# Altium project Car_Circuitry.PrjPcb
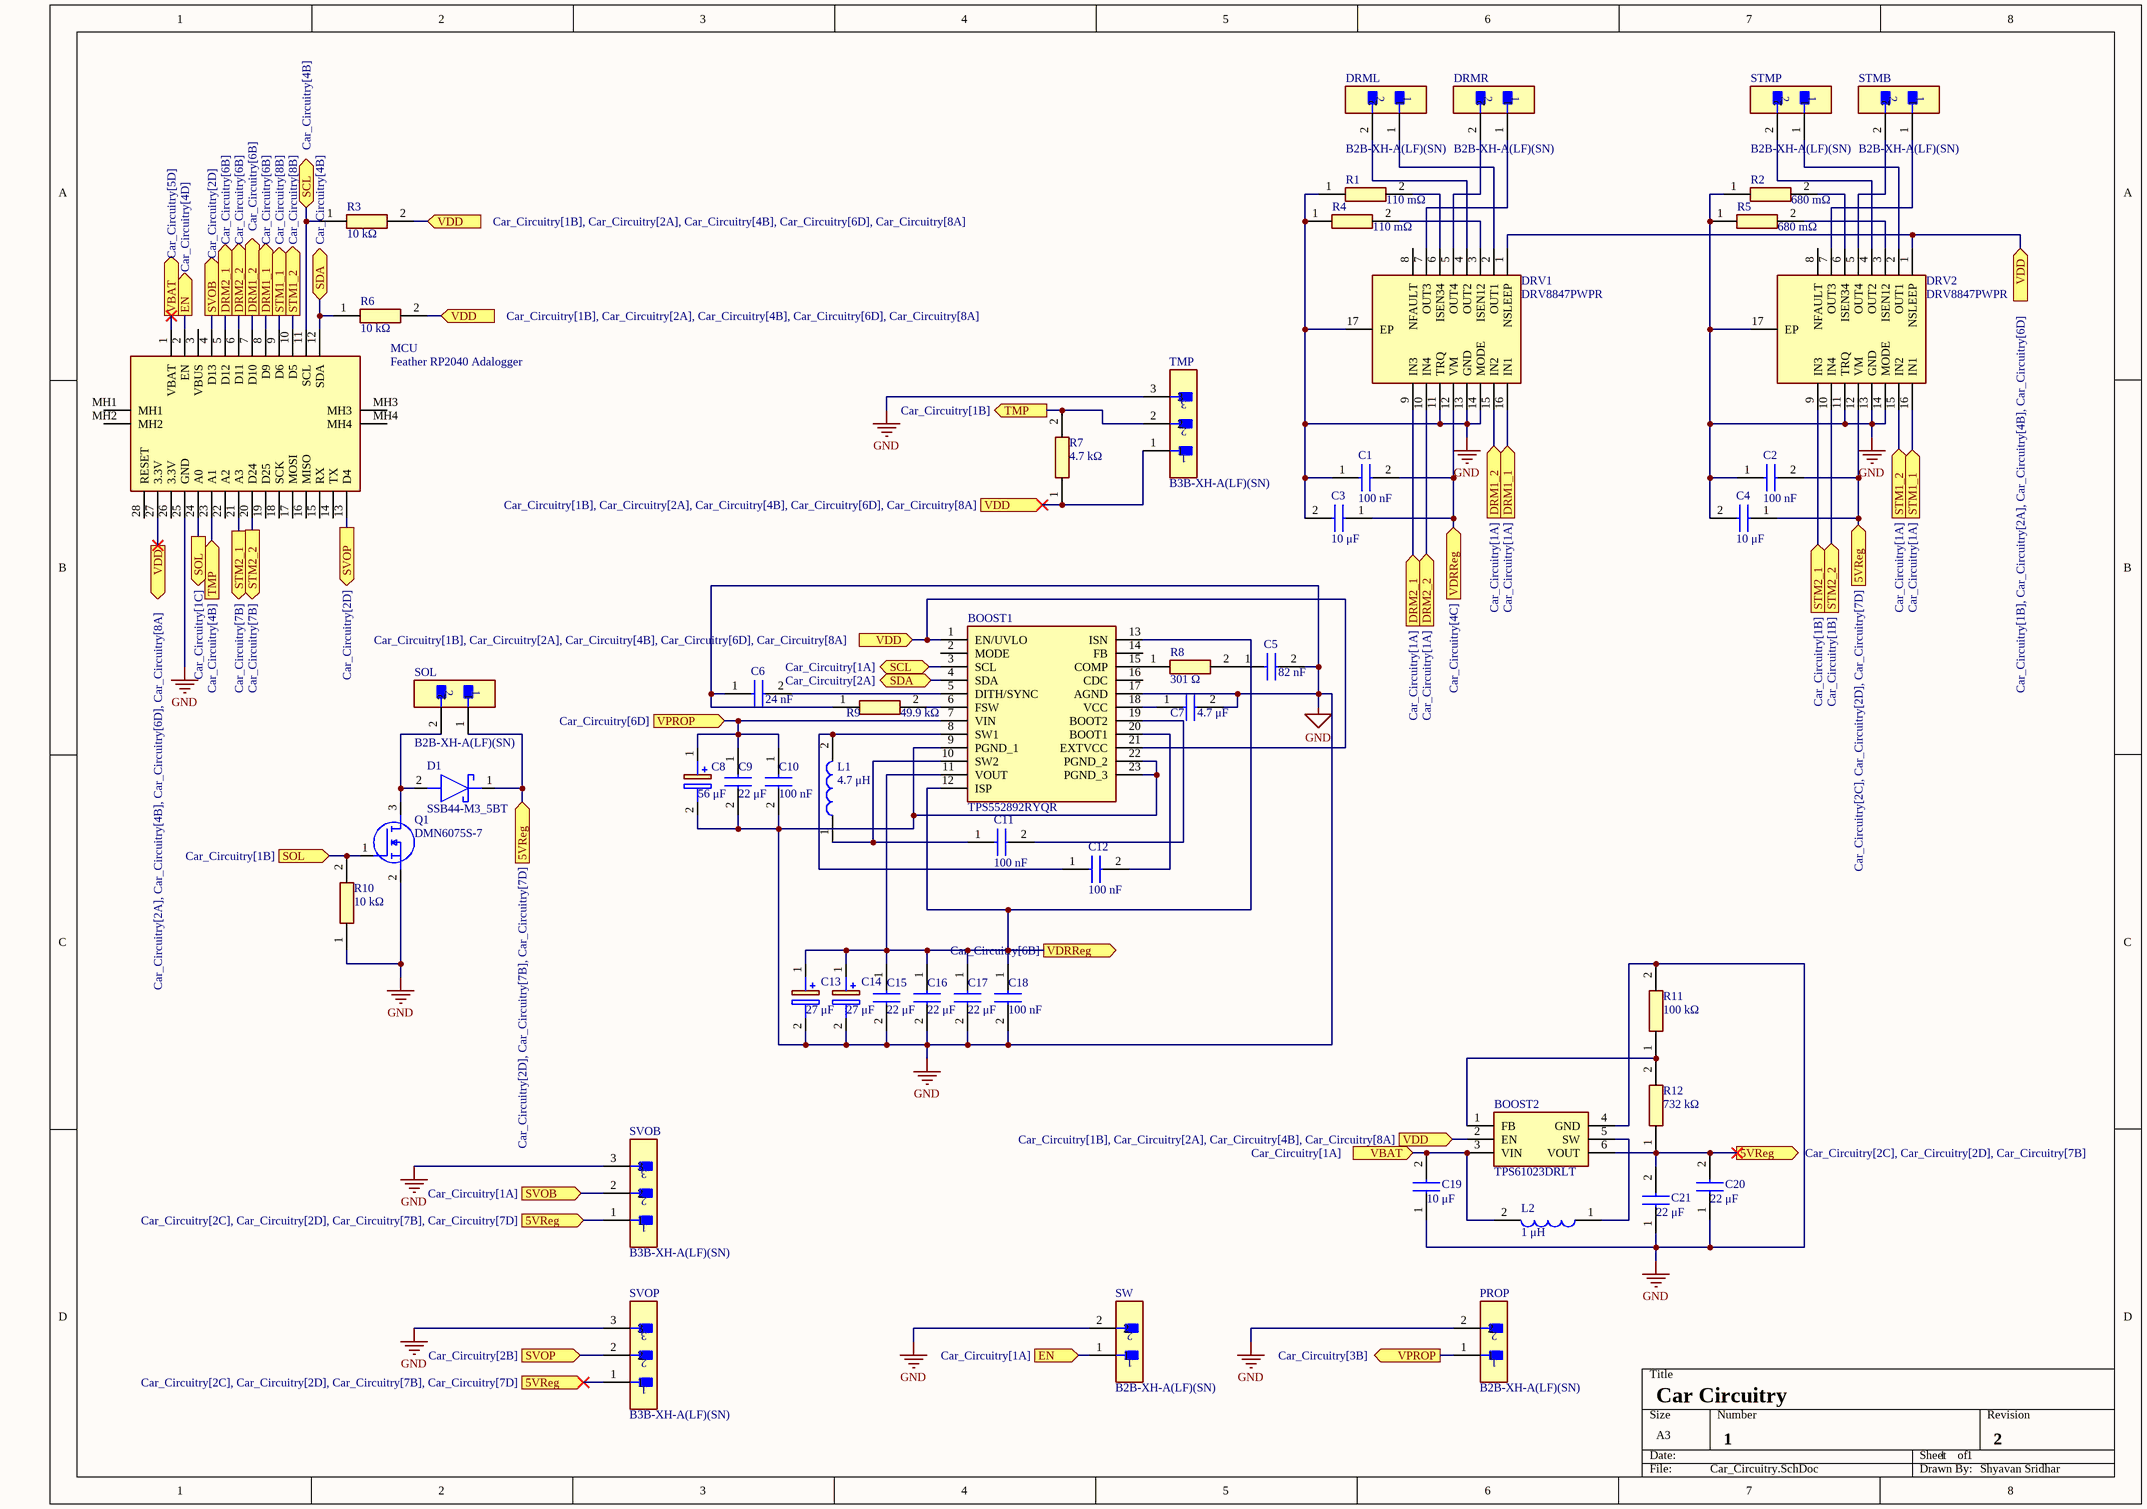
[diagram p0: Car_Circuitry.SchDoc]
2 sheets, 58 parts. Net scope: flat (ports and power ports of the same name join across sheets).
Board files: Car_Circuitry.PcbDoc, Steering_Daughterboard.PcbDoc
Sheets:
  Car_Circuitry.SchDoc
  Steering_Daughterboard.SchDoc

## Sheet Car_Circuitry.SchDoc
size A3; SheetNumber: 1; SheetTotal: 2

### Parts
BOOST1  TPS552892RYQR  [TPS552892RYQR]
BOOST2  TPS61023DRLT  [SOTFL50P160X60-6N]
C1  100 nF  [CAPC2012X95N]
C2  100 nF  [CAPC2012X95N]
C3  10 μF  [CAPC2012X140N]
C4  10 μF  [CAPC2012X140N]
C5  82 nF  [CAPC1005X55N]
C6  24 nF  [CAPC2013X94N]
C7  4.7 μF  [CAPC1608X80N]
C8  56 μF  [16SVF82M]
C9  22 μF  [CAPC3225X270N]
C10  100 nF  [CAPC1005X55N]
C11  100 nF  [CAPC1005X55N]
C12  100 nF  [CAPC1005X55N]
C13  27 μF  [16SVF82M]
C14  27 μF  [16SVF82M]
C15  22 μF  [CAPC3225X270N]
C16  22 μF  [CAPC3225X270N]
C17  22 μF  [CAPC3225X270N]
C18  100 nF  [CAPC1005X55N]
C19  10 μF  [CAPC2012X140N]
C20  22 μF  [CAPC3216X180N]
C21  22 μF  [CAPC3216X180N]
D1  SSB44-M3_5BT  [DIOM5436X244N]
DRML  B2B-XH-A(LF)(SN)  [FP-B2B-XH-A_LF_SN-MFG]
DRMR  B2B-XH-A(LF)(SN)  [FP-B2B-XH-A_LF_SN-MFG]
DRV1  DRV8847PWPR  [SOP65P640X120-17N]
DRV2  DRV8847PWPR  [SOP65P640X120-17N]
L1  4.7 μH  [INDPM6664X610N]
L2  1 μH  [74438357010]
MCU  Feather RP2040 Adalogger  [2796]
PROP  B2B-XH-A(LF)(SN)  [FP-B2B-XH-A_LF_SN-MFG]
Q1  DMN6075S-7  [SOT96P240X110-3N]
R1  110 mΩ  [ERJ6_B_BW_R_LW_CW_D]
R2  680 mΩ  [ERJ6_B_BW_R_LW_CW_D]
R3  10 kΩ  [RESC2012X70N]
R4  110 mΩ  [ERJ6_B_BW_R_LW_CW_D]
R5  680 mΩ  [ERJ6_B_BW_R_LW_CW_D]
R6  10 kΩ  [RESC2012X70N]
R7  4.7 kΩ  [RESAD1530W60L610D230]
R8  301 Ω  [RESC1005X40N]
R9  49.9 kΩ  [ERJ2RKD1004X]
R10  10 kΩ  [RESC2012X70N]
R11  100 kΩ  [ERJ8ENF1000V]
R12  732 kΩ  [ERJ8ENF1000V]
SOL  B2B-XH-A(LF)(SN)  [FP-B2B-XH-A_LF_SN-MFG]
STMB  B2B-XH-A(LF)(SN)  [FP-B2B-XH-A_LF_SN-MFG]
STMP  B2B-XH-A(LF)(SN)  [FP-B2B-XH-A_LF_SN-MFG]
SVOB  B3B-XH-A(LF)(SN)  [FP-B3B-XH-A_LF_SN-MFG]
SVOP  B3B-XH-A(LF)(SN)  [FP-B3B-XH-A_LF_SN-MFG]
SW  B2B-XH-A(LF)(SN)  [FP-B2B-XH-A_LF_SN-MFG]
TMP  B3B-XH-A(LF)(SN)  [FP-B3B-XH-A_LF_SN-MFG]

### Ports
5VReg (in, see Car_Circuitry[2C], Car_Circuitry[2D], Car_Circuitry[7B], Car_Circuitry[7D]), 5VReg (in, see Car_Circuitry[2C], Car_Circuitry[2D], Car_Circuitry[7D]), 5VReg (in, see Car_Circuitry[2D], Car_Circuitry[7B], Car_Circuitry[7D]), 5VReg (out, see Car_Circuitry[2C], Car_Circuitry[2D], Car_Circuitry[7B]), DRM1_1 (in, see Car_Circuitry[1A]), DRM1_1 (out, see Car_Circuitry[6B]), DRM1_2 (in, see Car_Circuitry[1A]), DRM1_2 (out, see Car_Circuitry[6B]), DRM2_1 (in, see Car_Circuitry[1A]), DRM2_1 (out, see Car_Circuitry[6B]), DRM2_2 (in, see Car_Circuitry[1A]), DRM2_2 (out, see Car_Circuitry[6B]), EN (in, see Car_Circuitry[1A]), EN (out, see Car_Circuitry[4D]), SCL (bidir, see Car_Circuitry[1A]), SCL (bidir, see Car_Circuitry[4B]), SDA (bidir, see Car_Circuitry[2A]), SDA (bidir, see Car_Circuitry[4B]), SOL (in, see Car_Circuitry[1B]), SOL (out, see Car_Circuitry[1C]), STM1_1 (in, see Car_Circuitry[1A]), STM1_1 (out, see Car_Circuitry[8B]), STM1_2 (in, see Car_Circuitry[1A]), STM1_2 (out, see Car_Circuitry[8B]), STM2_1 (in, see Car_Circuitry[1B]), STM2_1 (out, see Car_Circuitry[7B]), STM2_2 (in, see Car_Circuitry[1B]), STM2_2 (out, see Car_Circuitry[7B]), SVOB (in, see Car_Circuitry[1A]), SVOB (out, see Car_Circuitry[2D]), SVOP (in, see Car_Circuitry[2B]), SVOP (out, see Car_Circuitry[2D]), TMP (in, see Car_Circuitry[4B]), TMP (out, see Car_Circuitry[1B]), VBAT (in, see Car_Circuitry[1A]), VBAT (out, see Car_Circuitry[5D]), VDD (in, see Car_Circuitry[1B], Car_Circuitry[2A], Car_Circuitry[4B], Car_Circuitry[6D]), VDD (in, see Car_Circuitry[1B], Car_Circuitry[2A], Car_Circuitry[4B], Car_Circuitry[6D], Car_Circuitry[8A]), VDD (in, see Car_Circuitry[1B], Car_Circuitry[2A], Car_Circuitry[4B], Car_Circuitry[8A]), VDD (out, see Car_Circuitry[2A], Car_Circuitry[4B], Car_Circuitry[6D], Car_Circuitry[8A]), VDRReg (in, see Car_Circuitry[4C]), VDRReg (out, see Car_Circuitry[6B]), VPROP (in, see Car_Circuitry[6D]), VPROP (out, see Car_Circuitry[3B])

### Nets
GND: BOOST1.9(PGND_1) BOOST1.17(AGND) BOOST1.22(PGND_2) BOOST1.23(PGND_3) BOOST2.4(GND) C1.1 C2.1 C3.2 C4.2 C5.2 C6.1(C1) C7.2 C8.2(-) C9.2 C10.2 C13.2(-) C14.2(-) C15.2 C16.2 C17.2 C18.2 C19.1 C20.1 C21.1 DRV1.11(TRQ) DRV1.13(GND) DRV1.14(MODE) DRV1.17(EP) DRV2.11(TRQ) DRV2.13(GND) DRV2.14(MODE) DRV2.17(EP) MCU.25(GND) PROP.2 Q1.2(S) R1.1 R2.1 R4.1 R5.1 R9.1 R10.1 R11.2 SVOB.3 SVOP.3 SW.2 TMP.3
NetBOOST1_1: BOOST1.1(EN/UVLO) BOOST1.21(EXTVCC) BOOST2.2(EN) DRV1.1(NSLEEP) DRV2.1(NSLEEP) MCU.27(3.3V) R3.2 R6.2 R7.1 TMP.1 ; port VDD
NetBOOST1_3: BOOST1.3(SCL) MCU.11(SCL) R3.1 ; port SCL
NetBOOST1_4: BOOST1.4(SDA) MCU.12(SDA) R6.1 ; port SDA
NetBOOST1_5: BOOST1.5(DITH/SYNC) C6.2(C2)
NetBOOST1_6: BOOST1.6(FSW) R9.2
NetBOOST1_7: BOOST1.7(VIN) C8.1(+) C9.1 C10.1 PROP.1 ; port VPROP
NetBOOST1_8: BOOST1.8(SW1) C12.1 L1.2
NetBOOST1_10: BOOST1.10(SW2) C11.1 L1.1
NetBOOST1_11: BOOST1.11(VOUT) BOOST1.12(ISP) BOOST1.13(ISN) C1.2 C3.1 C13.1(+) C14.1(+) C15.1 C16.1 C17.1 C18.1 DRV1.12(VM) ; port VDRReg
NetBOOST1_15: BOOST1.15(COMP) R8.1
NetBOOST1_18: BOOST1.18(VCC) C7.1
NetBOOST1_19: BOOST1.19(BOOT2) C11.2
NetBOOST1_20: BOOST1.20(BOOT1) C12.2
NetBOOST2_1: BOOST2.1(FB) R11.1 R12.2
NetBOOST2_3: BOOST2.3(VIN) C19.2 L2.2 MCU.1(VBAT) ; port VBAT
NetBOOST2_5: BOOST2.5(SW) L2.1
NetBOOST2_6: BOOST2.6(VOUT) C2.2 C4.1 C20.2 C21.2 D1.1(K) DRV2.12(VM) R12.1 SOL.1 SVOB.1 SVOP.1 ; port 5VReg
NetC5_1: C5.1 R8.2
NetD1_2: D1.2(A) Q1.3(D) SOL.2
NetDRML_1: DRML.1 DRV1.2(OUT1)
NetDRML_2: DRML.2 DRV1.4(OUT2)
NetDRMR_1: DRMR.1 DRV1.7(OUT3)
NetDRMR_2: DRMR.2 DRV1.5(OUT4)
NetDRV1_3: DRV1.3(ISEN12) R4.2
NetDRV1_6: DRV1.6(ISEN34) R1.2
NetDRV1_9: DRV1.9(IN3) MCU.5(D12) ; port DRM2_1
NetDRV1_10: DRV1.10(IN4) MCU.6(D11) ; port DRM2_2
NetDRV1_15: DRV1.15(IN2) MCU.7(D10) ; port DRM1_2
NetDRV1_16: DRV1.16(IN1) MCU.8(D9) ; port DRM1_1
NetDRV2_2: DRV2.2(OUT1) STMP.1
NetDRV2_3: DRV2.3(ISEN12) R5.2
NetDRV2_4: DRV2.4(OUT2) STMP.2
NetDRV2_5: DRV2.5(OUT4) STMB.2
NetDRV2_6: DRV2.6(ISEN34) R2.2
NetDRV2_7: DRV2.7(OUT3) STMB.1
NetDRV2_9: DRV2.9(IN3) MCU.21(A3) ; port STM2_1
NetDRV2_10: DRV2.10(IN4) MCU.20(D24) ; port STM2_2
NetDRV2_15: DRV2.15(IN2) MCU.10(D5) ; port STM1_2
NetDRV2_16: DRV2.16(IN1) MCU.9(D6) ; port STM1_1
NetMCU_2: MCU.2(EN) SW.1 ; port EN
NetMCU_4: MCU.4(D13) SVOB.2 ; port SVOB
NetMCU_13: MCU.13(D4) SVOP.2 ; port SVOP
NetMCU_23: MCU.23(A1) R7.2 TMP.2 ; port TMP
NetMCU_24: MCU.24(A0) Q1.1(G) R10.2 ; port SOL

Not connected (* = marked no-connect by the designer): BOOST1 2(MODE) 14(FB) 16(CDC); DRV1 8(NFAULT); DRV2 8(NFAULT); MCU 3(VBUS) 14(TX) 15(RX) 16(MISO) 17(MOSI) 18(SCK) 19(D25) 22(A2) 26(3.3V) 28(RESET) MH1 MH2 MH3 MH4

### Notes on the sheet
- Car Circuitry
- 1
- 2
- Shyavan Sridhar

### Library data of the parts
BOOST1 = TPS552892RYQR: Integrated Circuit; Manufacturer_Name: Texas Instruments; Datasheet Link: https://www.ti.com/lit/ds/symlink/tps552892.pdf?ts=1698770017628&ref_url=https%253A%252F%252Fwww.ti.com%252Fsitesearch%252Fen-us%252Fdocs%252Funiversalsearch.tsp%253FlangPref%253Den-US%2526searchTerm%253DTPS552892RYQR%2526nr%253D8; Height: 1mm; Manufacturer_Part_Number: TPS552892RYQR; Mouser Part Number: 595-TPS552892RYQR; Mouser Price/Stock: https://www.mouser.co.uk/ProductDetail/Texas-Instruments/TPS552892RYQR?qs=ulEaXIWI0c%252B6pAm7sJRUGQ%3D%3D; Arrow Part Number: TPS552892RYQR; Arrow Price/Stock: https://www.arrow.com/en/products/tps552892ryqr/texas-instruments?region=nac
BOOST2 = TPS61023DRLT: Integrated Circuit; Manufacturer_Name: Texas Instruments; Datasheet Link: http://www.ti.com/general/docs/suppproductinfo.tsp?distId=10&gotoUrl=http%3A%2F%2Fwww.ti.com%2Flit%2Fgpn%2Ftps61023; Height: 0.6mm; Manufacturer_Part_Number: TPS61023DRLT; Mouser Part Number: 595-TPS61023DRLT; Mouser Price/Stock: https://www.mouser.co.uk/ProductDetail/Texas-Instruments/TPS61023DRLT?qs=BJlw7L4Cy78Zr3IJIU3gNw%3D%3D; Arrow Part Number: TPS61023DRLT; Arrow Price/Stock: https://www.arrow.com/en/products/tps61023drlt/texas-instruments?region=nac
C1 C2 = CL21B104KBCNNNC: Capacitor; Manufacturer_Name: SAMSUNG; Datasheet Link: https://datasheet.datasheetarchive.com/originals/distributors/Datasheets_SAMA/86a3eaf0882763ef32124d5901f9b833.pdf; Height: 0.95mm; Manufacturer_Part_Number: CL21B104KBCNNNC; Mouser Part Number: 187-CL21B104KBCNNNC; Mouser Price/Stock: https://www.mouser.co.uk/ProductDetail/Samsung-Electro-Mechanics/CL21B104KBCNNNC?qs=349EhDEZ59pEfpnm5yBEmQ%3D%3D; Arrow Part Number: CL21B104KBCNNNC; Arrow Price/Stock: https://www.arrow.com/en/products/cl21b104kbcnnnc/samsung-electro-mechanics?region=europe
C3 C4 C19 = CL21B106KOQNNNE: Capacitor; Manufacturer_Name: SAMSUNG; Datasheet Link: https://datasheet.datasheetarchive.com/originals/distributors/Datasheets_SAMA/a6a503886ec2e900bbf4e5d6e2f8e8b0.pdf; Height: 1.4mm; Manufacturer_Part_Number: CL21B106KOQNNNE; Mouser Part Number: 187-CL21B106KOQNNNE; Mouser Price/Stock: https://www.mouser.co.uk/ProductDetail/Samsung-Electro-Mechanics/CL21B106KOQNNNE?qs=349EhDEZ59r8qgLddyW2Yw%3D%3D; Arrow Part Number: CL21B106KOQNNNE; Arrow Price/Stock: https://www.arrow.com/en/products/cl21b106koqnnne/samsung-electro-mechanics
C5 = GRM155R61A823KA01D: Capacitor; Manufacturer_Name: Murata Electronics; Datasheet Link: https://search.murata.co.jp/Ceramy/image/img/A01X/G101/ENG/GRM155R61A823KA01-02A.pdf; Height: 0.55mm; Manufacturer_Part_Number: GRM155R61A823KA01D; Mouser Part Number: 81-GRM155R61A823KA1D; Mouser Price/Stock: https://www.mouser.co.uk/ProductDetail/Murata-Electronics/GRM155R61A823KA01D?qs=9U7yHM2lsjTmY4eOdx%2FDrA%3D%3D; Arrow Part Number: GRM155R61A823KA01D; Arrow Price/Stock: https://www.arrow.com/en/products/grm155r61a823ka01d/murata-manufacturing
C6 = 08051C243JAT2A: Capacitor; Manufacturer_Name: Kyocera AVX; Manufacturer_Part_Number: 08051C243JAT2A; Mouser Part Number: 581-08051C243JAT2A; Mouser Price/Stock: https://www.mouser.co.uk/ProductDetail/AVX/08051C243JAT2A?qs=TmFcSEGKcGVzRC3S3hofTg%3D%3D; Arrow Part Number: 08051C243JAT2A; Arrow Price/Stock: https://www.arrow.com/en/products/08051c243jat2a/avx
C7 = C1608X6S1C475K080AC: Capacitor; Manufacturer_Name: TDK; Datasheet Link: https://product.tdk.com/info/en/catalog/datasheets/mlcc_commercial_midvoltage_en.pdf; Height: 0.8mm; Manufacturer_Part_Number: C1608X6S1C475K080AC; Mouser Part Number: 810-C1608X6S1C475K; Mouser Price/Stock: https://www.mouser.co.uk/ProductDetail/TDK/C1608X6S1C475K080AC?qs=dfay7wIA1uELNO4%252B8xvBDw%3D%3D; Arrow Part Number: C1608X6S1C475K080AC; Arrow Price/Stock: https://www.arrow.com/en/products/c1608x6s1c475k080ac/tdk?region=nac
C8 = 20SVPF56MX: Capacitor Polarised; Manufacturer_Name: Panasonic; Datasheet Link: http://industrial.panasonic.com/cdbs/www-data/pdf/AAB8000/AAB8000C177.pdf; Height: 6mm; Manufacturer_Part_Number: 20SVPF56MX; Mouser Part Number: 667-20SVPF56MX; Mouser Price/Stock: https://www.mouser.co.uk/ProductDetail/Panasonic/20SVPF56MX?qs=OE1iw1LrrPFJ8spd6yzaew%3D%3D; Arrow Part Number: 20SVPF56MX; Arrow Price/Stock: https://www.arrow.com/en/products/20svpf56mx/panasonic?region=nac
C9 C15-C17 = GRM32ER61E226KE15K: Capacitor; Manufacturer_Name: Murata Electronics; Datasheet Link: https://search.murata.co.jp/Ceramy/image/img/A01X/G101/ENG/GRM32ER61E226KE15-01A.pdf; Height: 2.7mm; Manufacturer_Part_Number: GRM32ER61E226KE15K; Mouser Part Number: 81-GRM32ER61E226KE5K; Mouser Price/Stock: https://www.mouser.co.uk/ProductDetail/Murata-Electronics/GRM32ER61E226KE15K?qs=N3Kl9KD794SvgoeEaFEpLQ%3D%3D; Arrow Part Number: GRM32ER61E226KE15K; Arrow Price/Stock: https://www.arrow.com/en/products/grm32er61e226ke15k/murata-manufacturing?region=nac
C10-C12 C18 = CL05B104KA5NNNC: Capacitor; Manufacturer_Name: SAMSUNG; Datasheet Link: https://datasheet.datasheetarchive.com/originals/distributors/DKDS-19/372989.pdf; Height: 0.55mm; Manufacturer_Part_Number: CL05B104KA5NNNC; Mouser Part Number: 187-CL05B104KA5NNNC; Mouser Price/Stock: https://www.mouser.co.uk/ProductDetail/Samsung-Electro-Mechanics/CL05B104KA5NNNC?qs=Efv9o2T6U88DLyyMSzjXSQ%3D%3D; Arrow Part Number: CL05B104KA5NNNC; Arrow Price/Stock: https://www.arrow.com/en/products/cl05b104ka5nnnc/samsung-electro-mechanics?region=nac
C13 C14 = 25SVPF27MX: Capacitor Polarised; Manufacturer_Name: Panasonic; Datasheet Link: http://industrial.panasonic.com/cdbs/www-data/pdf/AAB8000/AAB8000C177.pdf; Height: 6mm; Manufacturer_Part_Number: 25SVPF27MX; Mouser Part Number: 667-25SVPF27MX; Mouser Price/Stock: https://www.mouser.co.uk/ProductDetail/Panasonic/25SVPF27MX?qs=OE1iw1LrrPHs7V8AgrsYgQ%3D%3D; Arrow Part Number: 25SVPF27MX; Arrow Price/Stock: https://www.arrow.com/en/products/25svpf27mx/panasonic?region=nac
C20 C21 = CL31B226KPHNNNE: Capacitor; Manufacturer_Name: SAMSUNG; Datasheet Link: https://media.digikey.com/pdf/Data%20Sheets/Samsung%20PDFs/CL_Series_MLCC_ds.pdf; Height: 1.8mm; Manufacturer_Part_Number: CL31B226KPHNNNE; Mouser Part Number: 187-CL31B226KPHNNNE; Mouser Price/Stock: https://www.mouser.co.uk/ProductDetail/Samsung-Electro-Mechanics/CL31B226KPHNNNE?qs=EHbfJsBkB6nWZLDFWYPW4w%3D%3D; Arrow Part Number: CL31B226KPHNNNE; Arrow Price/Stock: https://www.arrow.com/en/products/cl31b226kphnnne/samsung-electro-mechanics?region=nac
D1 = SSB44-M3_5BT: Schottky Diode; Manufacturer_Name: Vishay; Manufacturer_Part_Number: SSB44-M3/5BT; Datasheet Link: https://componentsearchengine.com/Datasheets/1/SSB44-M3_5BT.pdf; Height: 2.44mm; Mouser Part Number: 78-SSB44-M35BT; Mouser Price/Stock: https://www.mouser.co.uk/ProductDetail/Vishay-General-Semiconductor/SSB44-M3-5BT?qs=asPD7ZL2j3UPHHvFzBv%2F2A%3D%3D
DRML DRMR PROP SOL STMB STMP SW = CMP-2000-05888-3: CONN HEADER VERT 2POS 2.5MM; Current Rating: 3A; Voltage Rating: 250V; Number of Contacts: 2; Contact Resistance: 20mR; Wire/Cable Gauge: 22AWG; Insulation Resistance: 1GR; Connector Type: Male Pin; Packaging: Bulk; Contact Material: Brass; Lead Free: Lead Free; Orientation: Straight; Contact Plating: Tin; Max Current Rating: 3A; Termination: Solder; Fastening Type: Detent; Depth: 5.75mm; Housing Material: Polyamide; REACH SVHC: No SVHC; Series: XH; Voltage Rating (AC): 250V; Number of Positions: 2; Color: Natural; Contact Type: Male Pin; Max Voltage Rating (DC): 250V; Pitch: 2.5mm; Lead Pitch: 2.5mm; Mount: Through Hole; Max Operating Temperature: 85°C; Length: 7.4mm; Max Voltage Rating (AC): 250V; Min Operating Temperature: -25°C; Number of Rows: 1; Housing Color: White
DRV1 DRV2 = DRV8847PWPR: Integrated Circuit; Manufacturer_Name: Texas Instruments; Datasheet Link: http://www.ti.com/general/docs/lit/getliterature.tsp?genericPartNumber=DRV8847&fileType=pdf&HQS=ti-null-null-sf-df-pf-sep-wwe&DCM=yes; Height: 1.2mm; Manufacturer_Part_Number: DRV8847PWPR; Mouser Part Number: 595-DRV8847PWPR; Mouser Price/Stock: https://www.mouser.co.uk/ProductDetail/Texas-Instruments/DRV8847PWPR?qs=w%2Fv1CP2dgqrvdo8J8mfnIQ%3D%3D; Arrow Part Number: DRV8847PWPR; Arrow Price/Stock: https://www.arrow.com/en/products/drv8847pwpr/texas-instruments
L1 = 74439346047: Inductor; Manufacturer_Name: Wurth Elektronik; Datasheet Link: https://www.we-online.de/katalog/datasheet/74439346047.pdf; Manufacturer_Part_Number: 74439346047; Mouser Part Number: 710-74439346047; Mouser Price/Stock: https://www.mouser.co.uk/ProductDetail/Wurth-Elektronik/74439346047?qs=NSAOzM2zc%2FXlrbKP%2FopsOg%3D%3D; Height: 6.1mm
L2 = 74438357010: Inductor; Manufacturer_Name: Wurth Elektronik; Datasheet Link: https://katalog.we-online.de/pbs/datasheet/74438357010.pdf; Height: 3.1mm; Manufacturer_Part_Number: 74438357010; Mouser Part Number: 710-74438357010; Mouser Price/Stock: https://www.mouser.co.uk/ProductDetail/Wurth-Elektronik/74438357010?qs=AQlKX63v8RstGPuQmrueWg%3D%3D
MCU = 2796: Adafruit Microcontroller; Manufacturer_Part_Number: 4884; Datasheet Link: https://learn.adafruit.com/adafruit-feather-rp2040-adalogger/; Height: 8mm; Manufacturer_Name: Adafruit; Mouser Part Number: 485-5980; Mouser Price/Stock: https://www.mouser.com/ProductDetail/Adafruit/5980?qs=IKkN%2F947nfCnlS5PgbpnkA%3D%3D; Arrow Part Number: 4884; Arrow Price/Stock: https://www.arrow.com/en/products/4884/adafruit-industries
Q1 = DMN6075SQ-7: MOSFET (N-Channel); Manufacturer_Name: Diodes Incorporated; Datasheet Link: https://www.diodes.com//assets/Datasheets/DMN6075SQ.pdf; Height: 1.1mm; Manufacturer_Part_Number: DMN6075SQ-7; Mouser Part Number: 621-DMN6075SQ-7; Mouser Price/Stock: https://www.mouser.co.uk/ProductDetail/Diodes-Incorporated/DMN6075SQ-7?qs=OTrKUuiFdkZBTPnT%2F2GqPA%3D%3D; Arrow Part Number: DMN6075SQ-7; Arrow Price/Stock: https://www.arrow.com/en/products/dmn6075sq-7/diodes-incorporated?region=europe
R1 R4 = ERJ-6DSFR11V: Resistor; Manufacturer_Name: Panasonic; Datasheet Link: http://industrial.panasonic.com/cdbs/www-data/pdf/RDN0000/AOA0000C313.pdf; Manufacturer_Part_Number: ERJ-6DSFR11V; Mouser Part Number: 667-ERJ-6DSFR11V; Mouser Price/Stock: https://www.mouser.com/Search/Refine.aspx?Keyword=667-ERJ-6DSFR11V; Arrow Part Number: ERJ-6DSFR11V; Arrow Price/Stock: https://www.arrow.com/en/products/erj-6dsfr11v/panasonic?region=nac
R2 R5 = ERJ-6DQJR68V: Resistor; Manufacturer_Name: Panasonic; Datasheet Link: http://industrial.panasonic.com/cdbs/www-data/pdf/RDN0000/AOA0000C313.pdf; Manufacturer_Part_Number: ERJ-6DQJR68V; Arrow Part Number: ERJ-6DQJR68V; Arrow Price/Stock: https://www.arrow.com/en/products/erj-6dqjr68v/panasonic
R3 R6 R10 = ERJ-6GEYJ103V: Resistor; Manufacturer_Name: Panasonic; Datasheet Link: https://datasheet.datasheetarchive.com/originals/distributors/DKDS40/DSANUWW0010911.pdf; Height: 0.7mm; Manufacturer_Part_Number: ERJ-6GEYJ103V; Mouser Part Number: 667-ERJ-6GEYJ103V; Mouser Price/Stock: https://www.mouser.co.uk/ProductDetail/Panasonic/ERJ-6GEYJ103V?qs=tQNqqtTOejK5rw%252BRxJVxUA%3D%3D; Arrow Part Number: ERJ-6GEYJ103V; Arrow Price/Stock: https://www.arrow.com/en/products/erj6geyj103v/panasonic?region=nac
R7 = CF1_4C472J: Resistor; Manufacturer_Name: KOA Speer; Manufacturer_Part_Number: CF1/4C472J; Datasheet Link: https://componentsearchengine.com/Datasheets/1/CF1_4C472J.pdf; Mouser Part Number: 660-CF1/4C472J; Mouser Price/Stock: https://www.mouser.co.uk/ProductDetail/KOA-Speer/CF1-4C472J?qs=iBCKGqwqm%252BisgvQFSwWfkg%3D%3D; Arrow Part Number: CF1/4C472J; Arrow Price/Stock: https://www.arrow.com/en/products/cf14c472j/koa-speer-electronics?region=nac
R8 = CRCW0402301RFKED: Resistor; Manufacturer_Name: Vishay; Datasheet Link: http://www.vishay.com/docs/20035/dcrcwe3.pdf; Height: 0.4mm; Manufacturer_Part_Number: CRCW0402301RFKED; Mouser Part Number: 71-CRCW0402-301-E3; Mouser Price/Stock: https://www.mouser.co.uk/ProductDetail/Vishay-Dale/CRCW0402301RFKED?qs=TNtMkGKFKOyEoDLmqluwsQ%3D%3D
R9 = ERJ-2RKF4992X: Resistor; Manufacturer_Name: Panasonic; Datasheet Link: https://industrial.panasonic.com/cdbs/www-data/pdf/RDA0000/AOA0000C86.pdf; Height: 0.4mm; Manufacturer_Part_Number: ERJ-2RKF4992X; Mouser Part Number: 667-ERJ-2RKF4992X; Mouser Price/Stock: https://www.mouser.co.uk/ProductDetail/Panasonic/ERJ-2RKF4992X?qs=1iN9QGIZ5R%252Bb2pvOGnid7w%3D%3D; Arrow Part Number: ERJ-2RKF4992X; Arrow Price/Stock: https://www.arrow.com/en/products/erj-2rkf4992x/panasonic
R11 = ERJ-8ENF1003V: Resistor; Manufacturer_Name: Panasonic; Datasheet Link: https://industrial.panasonic.com/cdbs/www-data/pdf/RDA0000/AOA0000C86.pdf; Height: 0.7mm; Manufacturer_Part_Number: ERJ-8ENF1003V; Mouser Part Number: 667-ERJ-8ENF1003V; Mouser Price/Stock: https://www.mouser.co.uk/ProductDetail/Panasonic/ERJ-8ENF1003V?qs=8%252BG0TiN%2FgVoayg2hl%252BJeeg%3D%3D; Arrow Part Number: ERJ-8ENF1003V; Arrow Price/Stock: https://www.arrow.com/en/products/erj-8enf1003v/panasonic?region=nac
R12 = ERJ-8ENF7323V: Resistor; Manufacturer_Name: Panasonic; Datasheet Link: https://industrial.panasonic.com/cdbs/www-data/pdf/RDA0000/AOA0000C86.pdf; Height: 0.7mm; Manufacturer_Part_Number: ERJ-8ENF7323V; Mouser Part Number: 667-ERJ-8ENF7323V; Mouser Price/Stock: https://www.mouser.co.uk/ProductDetail/Panasonic/ERJ-8ENF7323V?qs=Ow%252BOiPmaljHJ6lt%2FbxwsiQ%3D%3D
SVOB SVOP TMP = CMP-17439-000014-3: CONN HEADER VERT 3POS 2.5MM; Max Voltage Rating (DC): 250V; Number of Positions: 3; Current Rating: 3A; Gender: Male; Wire/Cable Gauge: 22AWG; Contact Resistance: 20mR; Insulation Resistance: 1GR; Insulation Material: Nylon; Contact Plating: Tin; Depth: 5.75mm; Contact Type: Male Pin; Max Operating Temperature: 85°C; Insulation Color: Natural; Voltage Rating (AC): 250V; Color: Natural; Connector Type: Header; Orientation: Straight; Fastening Type: Detent; Housing Color: White; Min Operating Temperature: -25°C; Termination: Solder; Voltage Rating: 250V; Series: XH; Pitch: 2.5mm; Contact Shape: Square; Number of Rows: 1; Lead Free: Lead Free; Packaging: Bulk; Mount: Through Hole; Flammability Rating: UL94 V-0; Max Voltage Rating (AC): 250V; REACH SVHC: No SVHC; Housing Material: Polyamide; Contact Material: Brass; Lead Pitch: 2.5mm; Contact Finish - Mating: TIN; Length: 9.9mm; Max Current Rating: 3A; Number of Contacts: 3

## Sheet Steering_Daughterboard.SchDoc
size A4; SheetNumber: 2; SheetTotal: 2
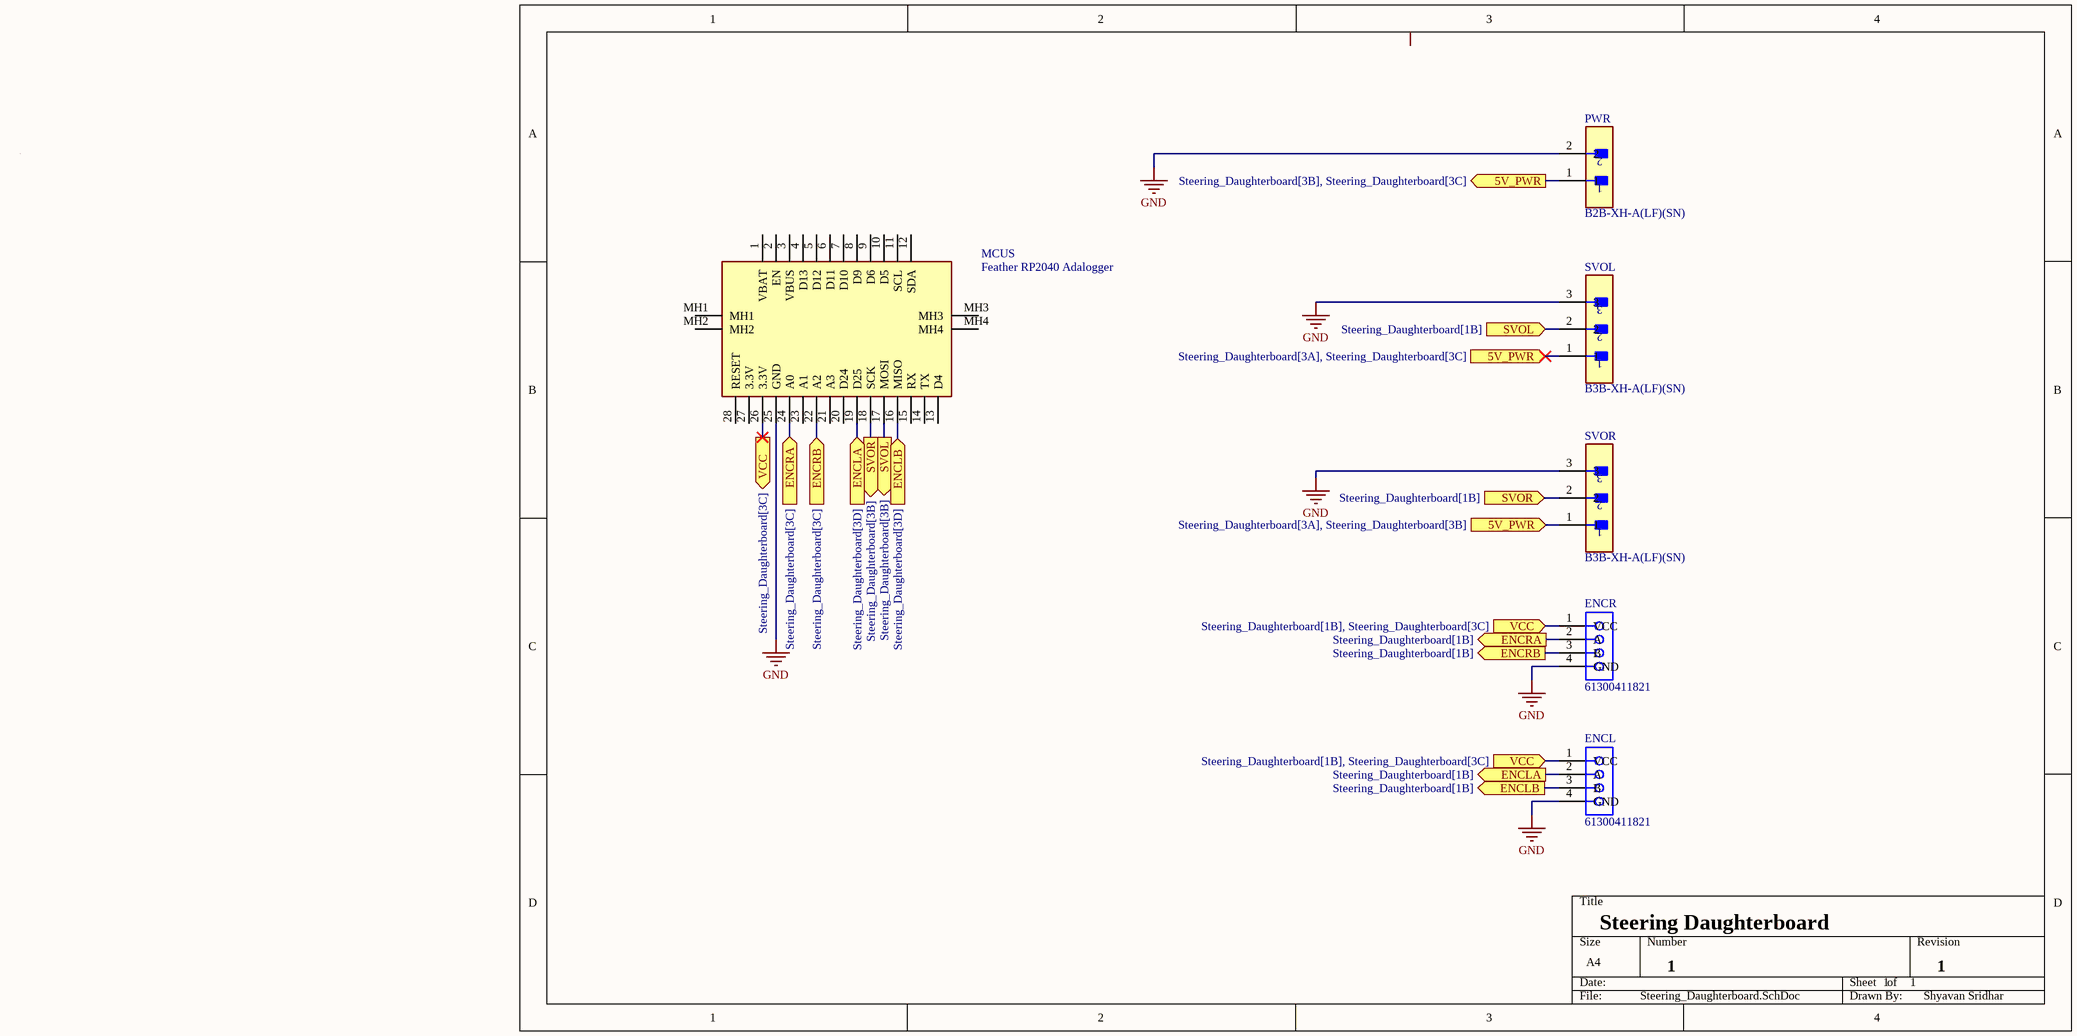
[diagram p1: Steering_Daughterboard.SchDoc]

### Parts
ENCL  61300411821  [61300411821]
ENCR  61300411821  [61300411821]
MCUS  Feather RP2040 Adalogger  [2796]
PWR  B2B-XH-A(LF)(SN)  [FP-B2B-XH-A_LF_SN-MFG]
SVOL  B3B-XH-A(LF)(SN)  [FP-B3B-XH-A_LF_SN-MFG]
SVOR  B3B-XH-A(LF)(SN)  [FP-B3B-XH-A_LF_SN-MFG]

### Ports
5V_PWR (in, see Steering_Daughterboard[3A], Steering_Daughterboard[3B]), 5V_PWR (in, see Steering_Daughterboard[3A], Steering_Daughterboard[3C]), 5V_PWR (out, see Steering_Daughterboard[3B], Steering_Daughterboard[3C]), ENCLA (in, see Steering_Daughterboard[3D]), ENCLA (out, see Steering_Daughterboard[1B]), ENCLB (in, see Steering_Daughterboard[3D]), ENCLB (out, see Steering_Daughterboard[1B]), ENCRA (in, see Steering_Daughterboard[3C]), ENCRA (out, see Steering_Daughterboard[1B]), ENCRB (in, see Steering_Daughterboard[3C]), ENCRB (out, see Steering_Daughterboard[1B]), SVOL (in, see Steering_Daughterboard[1B]), SVOL (out, see Steering_Daughterboard[3B]), SVOR (in, see Steering_Daughterboard[1B]), SVOR (out, see Steering_Daughterboard[3B]), VCC (in, see Steering_Daughterboard[1B], Steering_Daughterboard[3C]), VCC (out, see Steering_Daughterboard[3C])

### Nets
GND: ENCL.4(GND) ENCR.4(GND) MCUS.25(GND) PWR.2 SVOL.3 SVOR.3
NetENCL_1: ENCL.1(VCC) ENCR.1(VCC) MCUS.26(3.3V) ; port VCC
NetENCL_2: ENCL.2(A) MCUS.19(D25) ; port ENCLA
NetENCL_3: ENCL.3(B) MCUS.16(MISO) ; port ENCLB
NetENCR_2: ENCR.2(A) MCUS.24(A0) ; port ENCRA
NetENCR_3: ENCR.3(B) MCUS.22(A2) ; port ENCRB
NetMCUS_17: MCUS.17(MOSI) SVOL.2 ; port SVOL
NetMCUS_18: MCUS.18(SCK) SVOR.2 ; port SVOR
NetPWR_1: PWR.1 SVOL.1 SVOR.1 ; port 5V_PWR

Not connected (* = marked no-connect by the designer): MCUS 1(VBAT) 2(EN) 3(VBUS) 4(D13) 5(D12) 6(D11) 7(D10) 8(D9) 9(D6) 10(D5) 11(SCL) 12(SDA) 13(D4) 14(TX) 15(RX) 20(D24) 21(A3) 23(A1) 27(3.3V) 28(RESET) MH1 MH2 MH3 MH4

### Notes on the sheet
- Steering Daughterboard
- 1
- Shyavan Sridhar

### Library data of the parts
ENCL ENCR = CMP-1502-01316-3: NexarPartId: 61924712; Contact Resistance: 20mΩ; Gender: Female; Current Rating: 3A; Operating Supply Voltage: 250V; RoHS: Non-Compliant; Number of Pins: 4; Orientation: Vertical; Lead Pitch: 2.54mm
MCUS = 2796: as MCU on sheet Car_Circuitry; Datasheet Link: https://learn.adafruit.com/adafruit-feather-rp2040-adalogger/; Height: 8mm; Manufacturer_Name: Adafruit; Mouser Part Number: 485-5980; Mouser Price/Stock: https://www.mouser.com/ProductDetail/Adafruit/5980?qs=IKkN%2F947nfCnlS5PgbpnkA%3D%3D; Arrow Part Number: 4884; Arrow Price/Stock: https://www.arrow.com/en/products/4884/adafruit-industries
PWR = CMP-2000-05888-3: as DRML on sheet Car_Circuitry; Packaging: Bulk; Contact Material: Brass; Lead Free: Lead Free; Orientation: Straight; Contact Plating: Tin; Max Current Rating: 3A; Termination: Solder; Fastening Type: Detent; Depth: 5.75mm; Housing Material: Polyamide; REACH SVHC: No SVHC; Series: XH; Voltage Rating (AC): 250V; Number of Positions: 2; Color: Natural; Contact Type: Male Pin; Max Voltage Rating (DC): 250V; Pitch: 2.5mm; Lead Pitch: 2.5mm; Mount: Through Hole; Max Operating Temperature: 85°C; Length: 7.4mm; Max Voltage Rating (AC): 250V; Min Operating Temperature: -25°C; Number of Rows: 1; Housing Color: White
SVOL SVOR = CMP-17439-000014-3: as SVOB on sheet Car_Circuitry; Insulation Material: Nylon; Contact Plating: Tin; Depth: 5.75mm; Contact Type: Male Pin; Max Operating Temperature: 85°C; Insulation Color: Natural; Voltage Rating (AC): 250V; Color: Natural; Connector Type: Header; Orientation: Straight; Fastening Type: Detent; Housing Color: White; Min Operating Temperature: -25°C; Termination: Solder; Voltage Rating: 250V; Series: XH; Pitch: 2.5mm; Contact Shape: Square; Number of Rows: 1; Lead Free: Lead Free; Packaging: Bulk; Mount: Through Hole; Flammability Rating: UL94 V-0; Max Voltage Rating (AC): 250V; REACH SVHC: No SVHC; Housing Material: Polyamide; Contact Material: Brass; Lead Pitch: 2.5mm; Contact Finish - Mating: TIN; Length: 9.9mm; Max Current Rating: 3A; Number of Contacts: 3

## Nets that join several sheets
GND: Car_Circuitry (46 pins), Steering_Daughterboard (6 pins)